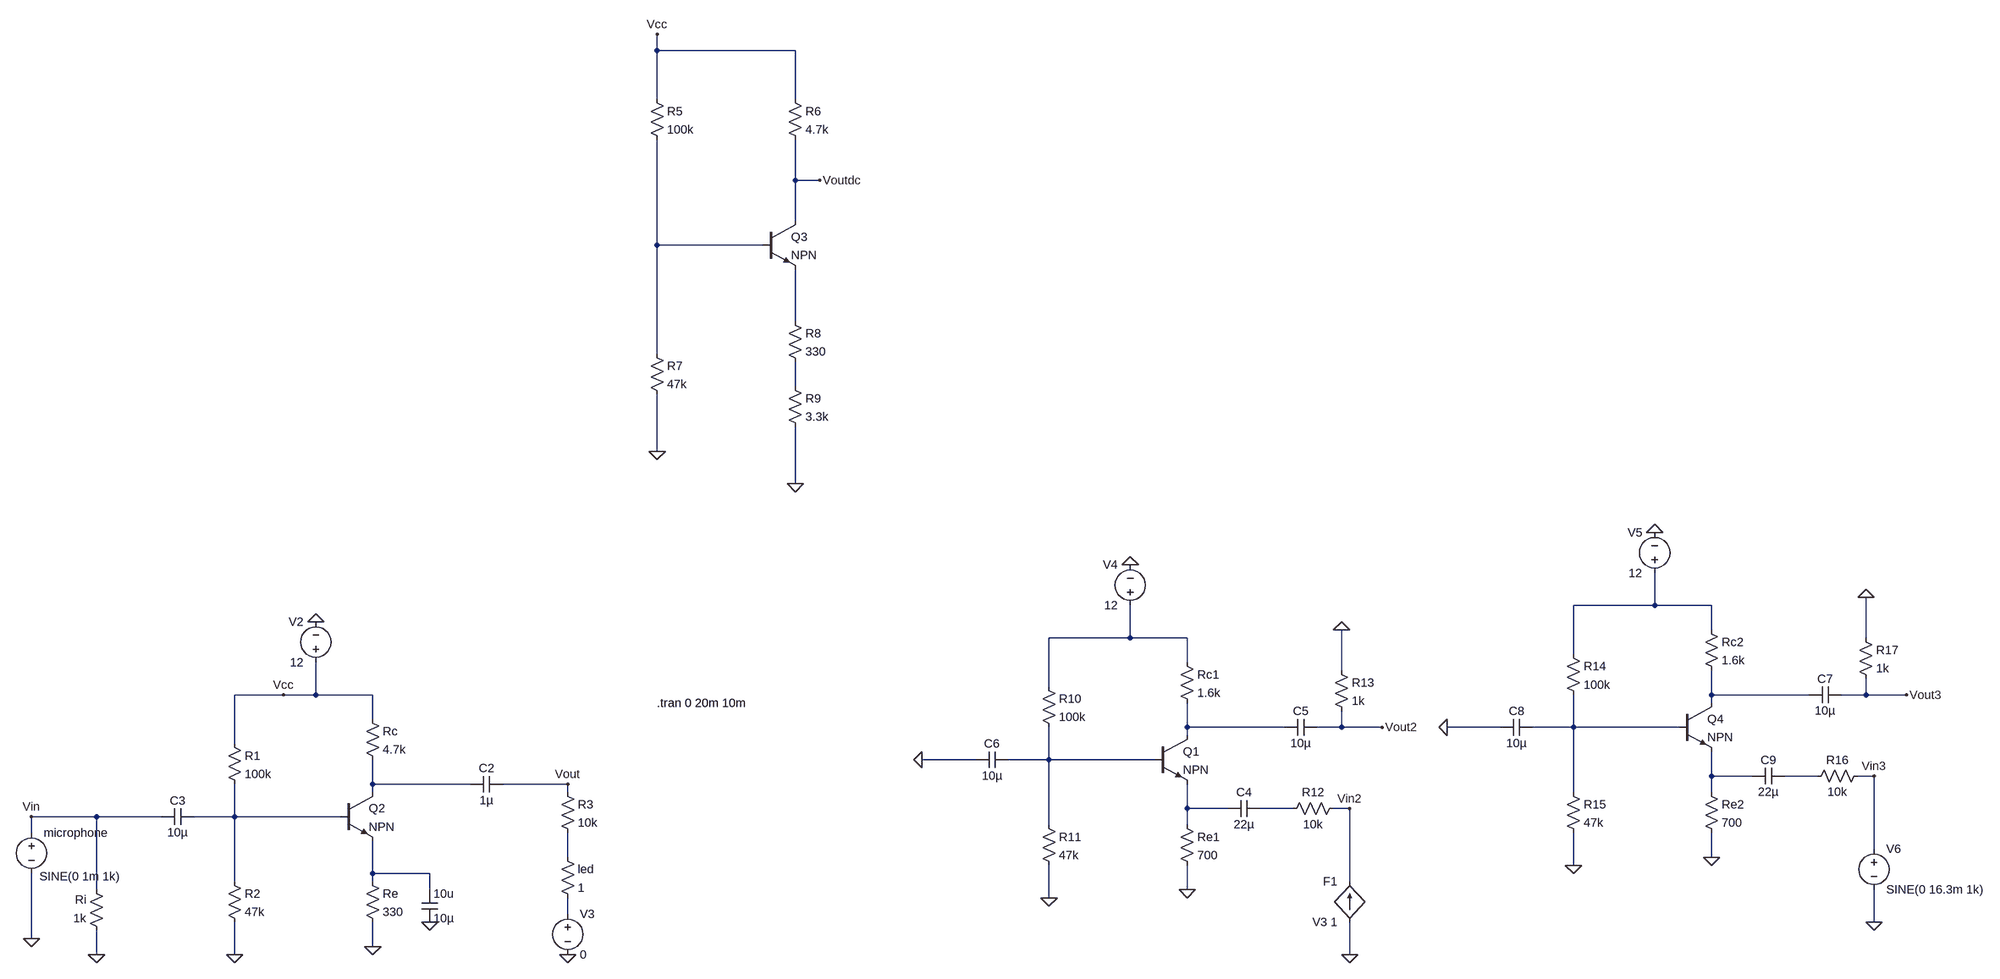
[diagram p0: schematic project_task1_deneme.asc]
project_task1_deneme.asc, the LTspice schematic file:
Version 4
SHEET 1 3276 680
WIRE 592 -1488 592 -1520
WIRE 864 -1488 592 -1488
WIRE 592 -1392 592 -1488
WIRE 864 -1392 864 -1488
WIRE 864 -1232 864 -1312
WIRE 912 -1232 864 -1232
WIRE 864 -1152 864 -1232
WIRE 592 -1104 592 -1312
WIRE 800 -1104 592 -1104
WIRE 864 -944 864 -1056
WIRE 592 -880 592 -1104
WIRE 864 -816 864 -864
WIRE 592 -688 592 -800
WIRE 864 -624 864 -736
WIRE 2608 -384 2608 -448
WIRE 2608 -384 2448 -384
WIRE 2720 -384 2608 -384
WIRE 2720 -336 2720 -384
WIRE 1552 -320 1552 -384
WIRE 1552 -320 1392 -320
WIRE 1664 -320 1552 -320
WIRE 3024 -320 3024 -400
WIRE 2448 -288 2448 -384
WIRE 1664 -272 1664 -320
WIRE 1968 -256 1968 -336
WIRE 1392 -224 1392 -320
WIRE -144 -208 -240 -208
WIRE -80 -208 -80 -272
WIRE -80 -208 -144 -208
WIRE 32 -208 -80 -208
WIRE 2720 -208 2720 -256
WIRE 2912 -208 2720 -208
WIRE 3024 -208 3024 -240
WIRE 3024 -208 2976 -208
WIRE 3104 -208 3024 -208
WIRE 2720 -192 2720 -208
WIRE 32 -160 32 -208
WIRE 1664 -144 1664 -192
WIRE 1856 -144 1664 -144
WIRE 1968 -144 1968 -176
WIRE 1968 -144 1920 -144
WIRE 2048 -144 1968 -144
WIRE 2304 -144 2176 -144
WIRE 2448 -144 2448 -208
WIRE 2448 -144 2368 -144
WIRE 2656 -144 2448 -144
WIRE 1664 -128 1664 -144
WIRE -240 -112 -240 -208
WIRE 1248 -80 1120 -80
WIRE 1392 -80 1392 -144
WIRE 1392 -80 1312 -80
WIRE 1600 -80 1392 -80
WIRE 2720 -48 2720 -96
WIRE 2800 -48 2720 -48
WIRE 2928 -48 2864 -48
WIRE 3040 -48 3008 -48
WIRE 32 -32 32 -80
WIRE 224 -32 32 -32
WIRE 416 -32 288 -32
WIRE 32 -16 32 -32
WIRE 416 -16 416 -32
WIRE 2448 -16 2448 -144
WIRE 2720 -16 2720 -48
WIRE 1664 16 1664 -32
WIRE 1744 16 1664 16
WIRE 1872 16 1808 16
WIRE 1984 16 1952 16
WIRE -512 32 -640 32
WIRE -384 32 -512 32
WIRE -240 32 -240 -32
WIRE -240 32 -320 32
WIRE -32 32 -240 32
WIRE 1392 48 1392 -80
WIRE 1664 48 1664 16
WIRE -640 64 -640 32
WIRE 3040 96 3040 -48
WIRE 416 112 416 64
WIRE 2720 112 2720 64
WIRE 2448 128 2448 64
WIRE 32 144 32 80
WIRE 144 144 32 144
WIRE -240 160 -240 32
WIRE 32 160 32 144
WIRE 1984 160 1984 16
WIRE -512 176 -512 32
WIRE 144 176 144 144
WIRE 1664 176 1664 128
WIRE 1392 192 1392 128
WIRE 416 224 416 192
WIRE 3040 240 3040 176
WIRE -640 272 -640 144
WIRE 32 288 32 240
WIRE -512 304 -512 256
WIRE -240 304 -240 240
WIRE 1984 304 1984 240
FLAG -640 272 0
FLAG -240 304 0
FLAG -640 32 Vin
FLAG -144 -208 Vcc
FLAG 416 -32 Vout
FLAG -80 -352 0
FLAG -512 304 0
FLAG 864 -624 0
FLAG 592 -688 0
FLAG 592 -1520 Vcc
FLAG 912 -1232 Voutdc
FLAG 1392 192 0
FLAG 1552 -464 0
FLAG 1120 -80 0
FLAG 1984 304 0
FLAG 1664 176 0
FLAG 1968 -336 0
FLAG 2048 -144 Vout2
FLAG 416 304 0
FLAG 1984 16 Vin2
FLAG 2448 128 0
FLAG 2608 -528 0
FLAG 2176 -144 0
FLAG 3040 240 0
FLAG 2720 112 0
FLAG 3024 -400 0
FLAG 3104 -208 Vout3
FLAG 3040 -48 Vin3
FLAG 144 240 0
FLAG 32 288 0
SYMBOL res -256 -128 R0
SYMATTR InstName R1
SYMATTR Value 100k
SYMBOL res 16 -176 R0
SYMATTR InstName Rc
SYMATTR Value 4.7k
SYMBOL res -256 144 R0
SYMATTR InstName R2
SYMATTR Value 47k
SYMBOL res 16 144 R0
SYMATTR InstName Re
SYMATTR Value 330
SYMBOL cap 288 -48 R90
WINDOW 0 0 32 VBottom 2
WINDOW 3 32 32 VTop 2
SYMATTR InstName C2
SYMATTR Value 1µ
SYMBOL res -496 272 R180
WINDOW 0 36 76 Left 2
WINDOW 3 36 40 Left 2
SYMATTR InstName Ri
SYMATTR Value 1k
SYMBOL cap -320 16 R90
WINDOW 0 0 32 VBottom 2
WINDOW 3 32 32 VTop 2
SYMATTR InstName C3
SYMATTR Value 10µ
SYMBOL voltage -640 48 R0
WINDOW 123 24 124 Left 2
WINDOW 39 0 0 Left 0
WINDOW 3 16 102 Left 2
SYMATTR Value SINE(0 1m 1k)
SYMATTR InstName microphone
SYMBOL voltage -80 -256 R180
WINDOW 0 24 96 Left 2
WINDOW 3 24 16 Left 2
WINDOW 123 0 0 Left 0
WINDOW 39 0 0 Left 0
SYMATTR InstName V2
SYMATTR Value 12
SYMBOL res 400 -32 R0
SYMATTR InstName R3
SYMATTR Value 10k
SYMBOL res 576 -1408 R0
SYMATTR InstName R5
SYMATTR Value 100k
SYMBOL res 848 -1408 R0
SYMATTR InstName R6
SYMATTR Value 4.7k
SYMBOL res 576 -896 R0
SYMATTR InstName R7
SYMATTR Value 47k
SYMBOL res 848 -960 R0
SYMATTR InstName R8
SYMATTR Value 330
SYMBOL res 848 -832 R0
SYMATTR InstName R9
SYMATTR Value 3.3k
SYMBOL res 400 96 R0
SYMATTR InstName led
SYMATTR Value 1
SYMBOL res 1376 -240 R0
SYMATTR InstName R10
SYMATTR Value 100k
SYMBOL res 1648 -288 R0
SYMATTR InstName Rc1
SYMATTR Value 1.6k
SYMBOL res 1376 32 R0
SYMATTR InstName R11
SYMATTR Value 47k
SYMBOL res 1648 32 R0
SYMATTR InstName Re1
SYMATTR Value 700
SYMBOL cap 1920 -160 R90
WINDOW 0 0 32 VBottom 2
WINDOW 3 32 32 VTop 2
SYMATTR InstName C5
SYMATTR Value 10µ
SYMBOL cap 1312 -96 R90
WINDOW 0 0 32 VBottom 2
WINDOW 3 32 32 VTop 2
SYMATTR InstName C6
SYMATTR Value 10µ
SYMBOL voltage 1552 -368 R180
WINDOW 0 24 96 Left 2
WINDOW 3 24 16 Left 2
WINDOW 123 0 0 Left 0
WINDOW 39 0 0 Left 0
SYMATTR InstName V4
SYMATTR Value 12
SYMBOL cap 1808 0 R90
WINDOW 0 0 32 VBottom 2
WINDOW 3 32 32 VTop 2
SYMATTR InstName C4
SYMATTR Value 22µ
SYMBOL res 1968 0 R90
WINDOW 0 0 56 VBottom 2
WINDOW 3 32 56 VTop 2
SYMATTR InstName R12
SYMATTR Value 10k
SYMBOL res 1952 -272 R0
SYMATTR InstName R13
SYMATTR Value 1k
SYMBOL f 1984 240 R180
WINDOW 0 24 80 Left 2
WINDOW 3 24 0 Left 2
SYMATTR InstName F1
SYMATTR Value V3 1
SYMBOL voltage 416 208 R0
WINDOW 123 0 0 Left 0
WINDOW 39 0 0 Left 0
SYMATTR InstName V3
SYMATTR Value 0
SYMBOL npn 1600 -128 R0
SYMATTR InstName Q1
SYMBOL npn -32 -16 R0
SYMATTR InstName Q2
SYMBOL npn 800 -1152 R0
SYMATTR InstName Q3
SYMBOL res 2432 -304 R0
SYMATTR InstName R14
SYMATTR Value 100k
SYMBOL res 2704 -352 R0
SYMATTR InstName Rc2
SYMATTR Value 1.6k
SYMBOL res 2432 -32 R0
SYMATTR InstName R15
SYMATTR Value 47k
SYMBOL res 2704 -32 R0
SYMATTR InstName Re2
SYMATTR Value 700
SYMBOL cap 2976 -224 R90
WINDOW 0 0 32 VBottom 2
WINDOW 3 32 32 VTop 2
SYMATTR InstName C7
SYMATTR Value 10µ
SYMBOL cap 2368 -160 R90
WINDOW 0 0 32 VBottom 2
WINDOW 3 32 32 VTop 2
SYMATTR InstName C8
SYMATTR Value 10µ
SYMBOL voltage 2608 -432 R180
WINDOW 0 24 96 Left 2
WINDOW 3 24 16 Left 2
WINDOW 123 0 0 Left 0
WINDOW 39 0 0 Left 0
SYMATTR InstName V5
SYMATTR Value 12
SYMBOL cap 2864 -64 R90
WINDOW 0 0 32 VBottom 2
WINDOW 3 32 32 VTop 2
SYMATTR InstName C9
SYMATTR Value 22µ
SYMBOL res 3024 -64 R90
WINDOW 0 0 56 VBottom 2
WINDOW 3 32 56 VTop 2
SYMATTR InstName R16
SYMATTR Value 10k
SYMBOL res 3008 -336 R0
SYMATTR InstName R17
SYMATTR Value 1k
SYMBOL npn 2656 -192 R0
SYMATTR InstName Q4
SYMBOL voltage 3040 80 R0
WINDOW 123 0 0 Left 0
WINDOW 39 0 0 Left 0
SYMATTR InstName V6
SYMATTR Value SINE(0 16.3m 1k)
SYMBOL cap 128 176 R0
SYMATTR InstName 10u
SYMATTR Value 10µ
TEXT 592 -192 Left 2 !.tran 0 20m 10m

The netlist it stands for:
* project_task1_deneme.asc
R1 Vcc N015 100k
Rc Vcc N012 4.7k
R2 N015 0 47k
Re N017 0 330
C2 Vout N012 1µ
Ri 0 Vin 1k
C3 N015 Vin 10µ
V§microphone Vin 0 SINE(0 1m 1k)
V2 Vcc 0 12
R3 Vout N016 10k
R5 Vcc N001 100k
R6 Vcc Voutdc 4.7k
R7 N001 0 47k
R8 N002 N003 330
R9 N003 0 3.3k
R§led N016 N018 1
R10 N005 N009 100k
Rc1 N005 N007 1.6k
R11 N009 0 47k
Re1 N013 0 700
C5 Vout2 N007 10µ
C6 N009 0 10µ
V4 N005 0 12
C4 N014 N013 22µ
R12 Vin2 N014 10k
R13 0 Vout2 1k
F1 0 Vin2 V3 1
V3 N018 0 0
Q1 N007 N009 N013 0 NPN
Q2 N012 N015 N017 0 NPN
Q3 Voutdc N001 N002 0 NPN
R14 N004 N008 100k
Rc2 N004 N006 1.6k
R15 N008 0 47k
Re2 N010 0 700
C7 Vout3 N006 10µ
C8 N008 0 10µ
V5 N004 0 12
C9 N011 N010 22µ
R16 Vin3 N011 10k
R17 0 Vout3 1k
Q4 N006 N008 N010 0 NPN
V6 Vin3 0 SINE(0 16.3m 1k)
C§10u N017 0 10µ
.model NPN NPN
.model PNP PNP
.lib standard.bjt
.tran 0 20m 10m
.backanno
.end